# EAGLE design DAC_Production (EAGLE 9.0.0)
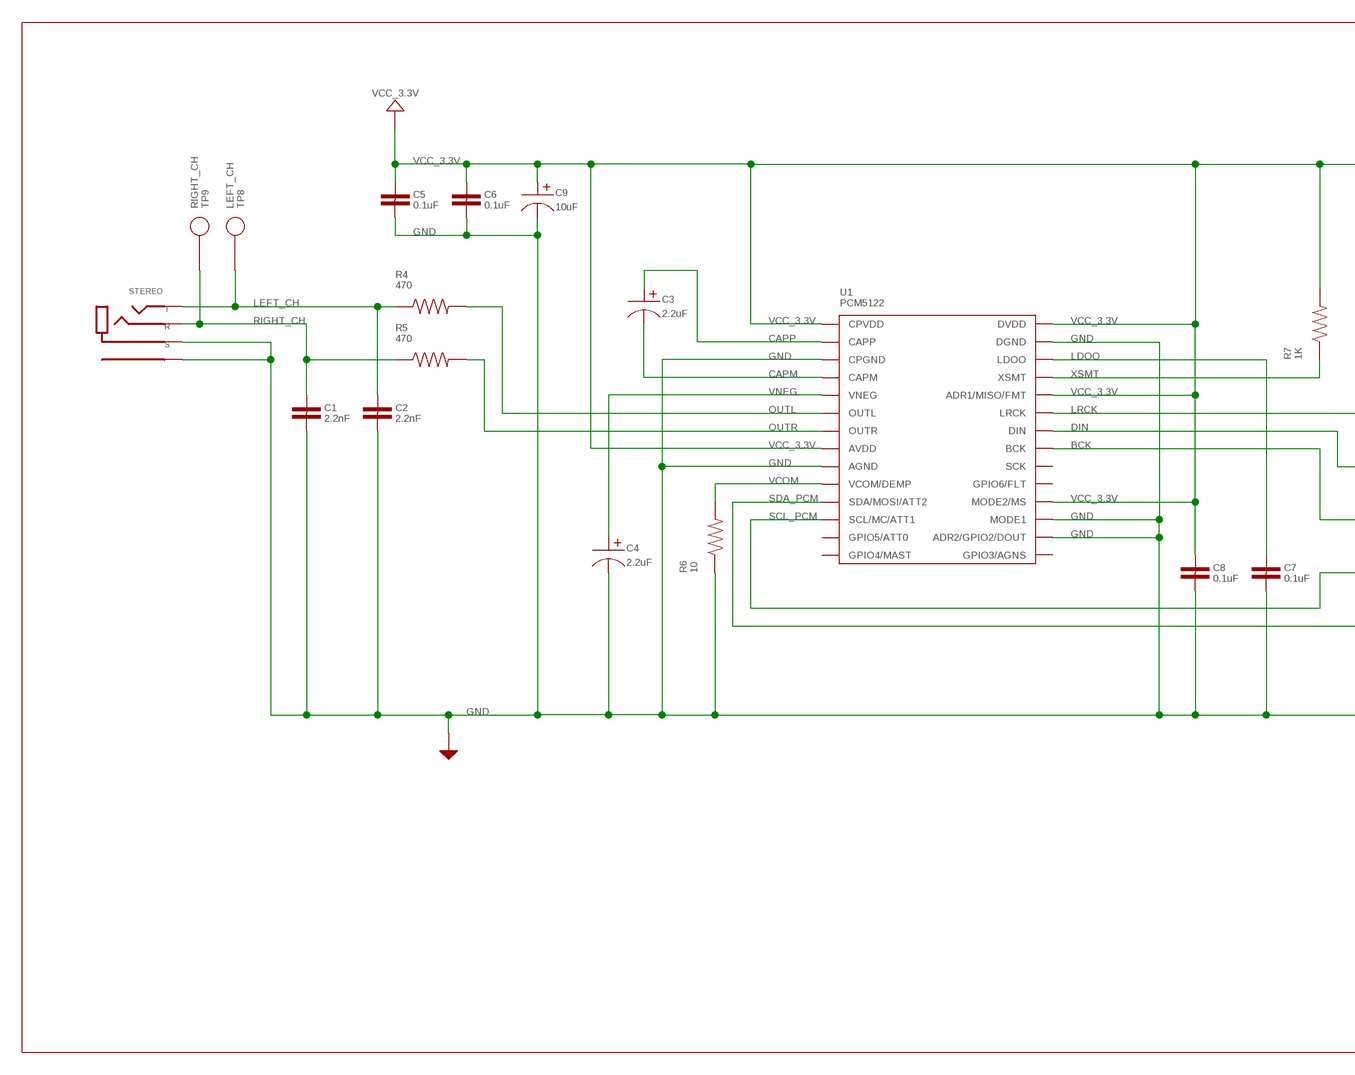
[diagram p0: schematic, sheet 1, part 1 of 2]
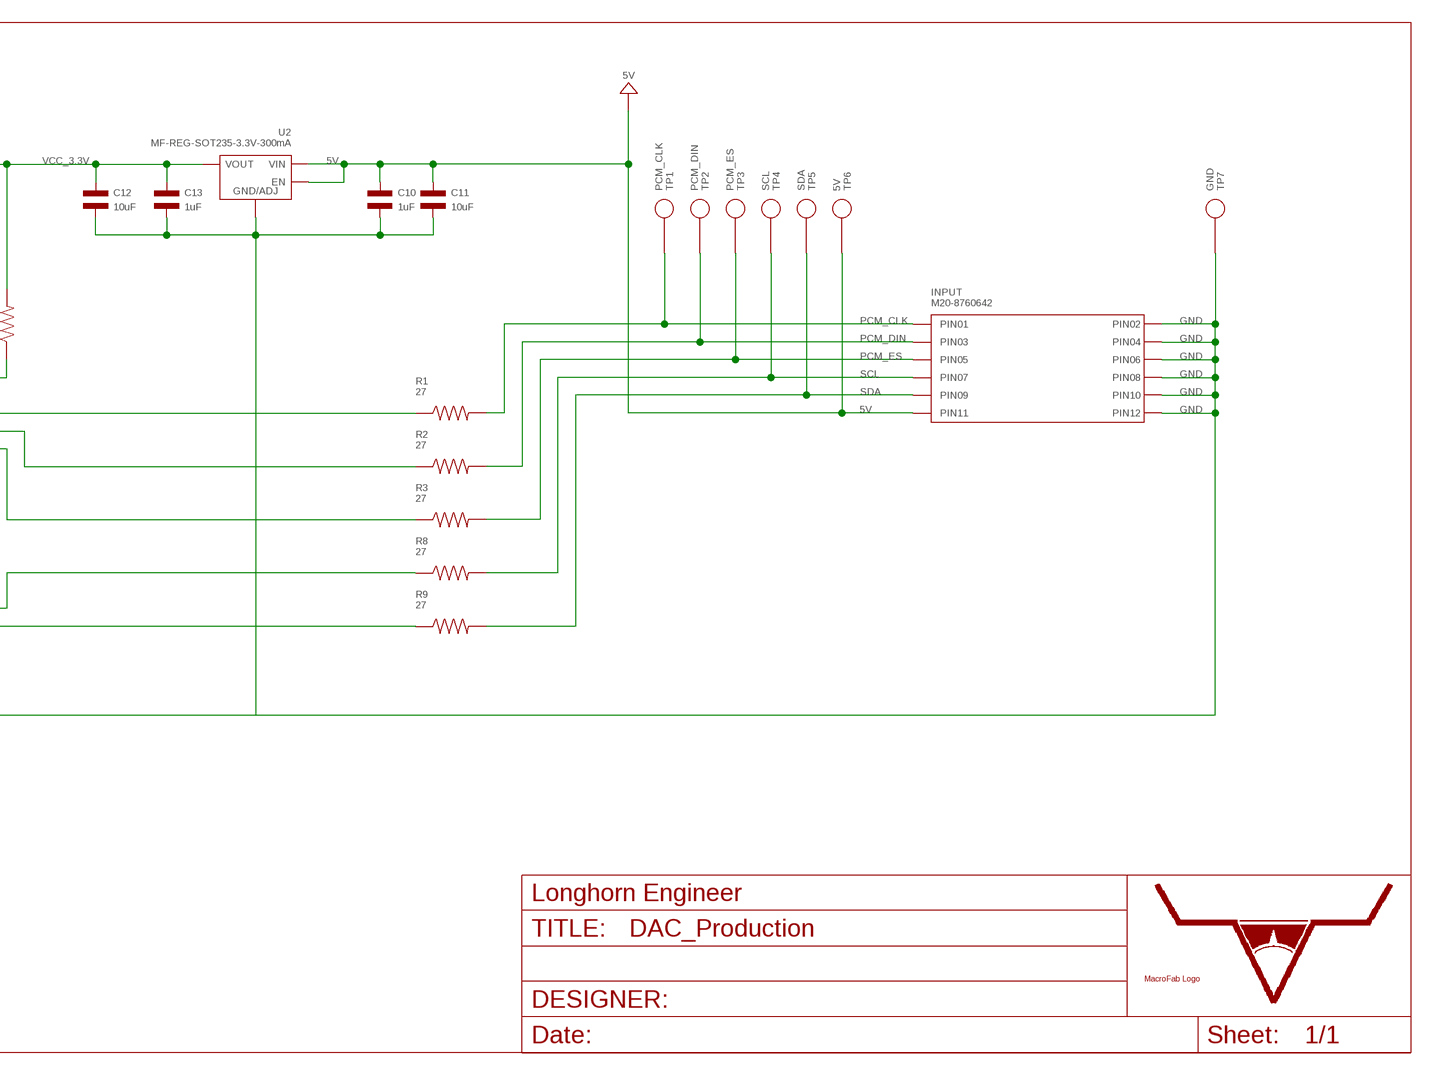
[diagram p1: schematic, sheet 1, part 2 of 2]

## Parts
C1  2.2nF  CAPACITOR_NON_POLAR_0805  [0805]
C2  2.2nF  CAPACITOR_NON_POLAR_0805  [0805]
C3  2.2uF  CAPACITOR_P_4MM  [CP4MM]
C4  2.2uF  CAPACITOR_P_4MM  [CP4MM]
C5  0.1uF  CAPACITOR_NON_POLAR_0805  [0805]
C6  0.1uF  CAPACITOR_NON_POLAR_0805  [0805]
C7  0.1uF  CAPACITOR_NON_POLAR_0805  [0805]
C8  0.1uF  CAPACITOR_NON_POLAR_0805  [0805]
C9  10uF  CAPACITOR_P_4MM  [CP4MM]
C10  1uF  CAPACITOR_NP_0805  [C0805]
C11  10uF  CAPACITOR_NP_1206  [C1206]
C12  10uF  CAPACITOR_NP_1206  [C1206]
C13  1uF  CAPACITOR_NP_0805  [C0805]
INPUT  M20-8760642  CON_02X06_M20-8760642  [M20-8760642]
R1  27  RESISTOR_0603  [0603]
R2  27  RESISTOR_0603  [0603]
R3  27  RESISTOR_0603  [0603]
R4  470  RESISTOR_0603  [0603]
R5  470  RESISTOR_0603  [0603]
R6  10  RESISTOR_0603  [0603]
R7  1K  RESISTOR_0603  [0603]
R8  27  RESISTOR_0603  [0603]
R9  27  RESISTOR_0603  [0603]
STEREO  TRS_SHIELD_JACK_SJ1-3533NS  [SJ1-3533NS]
TP1  PCM_CLK  TEST_POINT_SINGLE_ROUND_1MM  [ROUND_TP]
TP2  PCM_DIN  TEST_POINT_SINGLE_ROUND_1MM  [ROUND_TP]
TP3  PCM_ES  TEST_POINT_SINGLE_ROUND_1MM  [ROUND_TP]
TP4  SCL  TEST_POINT_SINGLE_ROUND_1MM  [ROUND_TP]
TP5  SDA  TEST_POINT_SINGLE_ROUND_1MM  [ROUND_TP]
TP6  5V  TEST_POINT_SINGLE_ROUND_1MM  [ROUND_TP]
TP7  GND  TEST_POINT_SINGLE_ROUND_1MM  [ROUND_TP]
TP8  LEFT_CH  TEST_POINT_SINGLE_ROUND_1MM  [ROUND_TP]
TP9  RIGHT_CH  TEST_POINT_SINGLE_ROUND_1MM  [ROUND_TP]
U1  PCM5122  PCM512X  [PCM5122_TTSOP-28]
U2  MF-REG-SOT235-3.3V-300mA  TLV70233PDBVR  [SOT-23-5]
U$8  LHE_FRAME  [LHE_FRAME]
U$9  MF_LOGOLOGO_MEDIUM  [MF_LOGO_MEDIUM]

## Nets
5V: C10.P$1 C11.P$1 INPUT.P$11(PIN11) TP6.P$1 U2.P$1(VIN) U2.P$3(EN)
BCK: R3.1 U1.P$21(BCK)
CAPM: C3.P$2 U1.P$4(CAPM)
CAPP: C3.P$1 U1.P$2(CAPP)
DIN: R2.1 U1.P$22(DIN)
GND: C1.2 C2.2 C4.P$2 C5.2 C6.2 C7.2 C8.2 C9.P$2 C10.P$2 C11.P$2 C12.P$2 C13.P$2 INPUT.P$2(PIN2) INPUT.P$4(PIN4) INPUT.P$6(PIN6) INPUT.P$8(PIN8) INPUT.P$10(PIN10) INPUT.P$12(PIN12) R6.1 STEREO.1_A(S) STEREO.1_B(S) STEREO.S1(SHIELD) STEREO.S2(SHIELD) STEREO.S3(SHIELD) STEREO.S4(SHIELD) STEREO.S5(SHIELD) STEREO.S6(SHIELD) TP7.P$1 U1.P$3(CPGND) U1.P$9(AGND) U1.P$16(ADR2/GPIO2/DOUT) U1.P$17(MODE1) U1.P$27(DGND) U2.P$2(GND/ADJ)
LDOO: C7.1 U1.P$26(LDOO)
LEFT_CH: C2.1 R4.1 STEREO.2_A(T) STEREO.2_B(T) TP8.P$1
LRCK: R1.1 U1.P$23(LRCK)
OUTL: R4.2 U1.P$6(OUTL)
OUTR: R5.2 U1.P$7(OUTR)
PCM_CLK: INPUT.P$1(PIN1) R1.2 TP1.P$1
PCM_DIN: INPUT.P$3(PIN3) R2.2 TP2.P$1
PCM_ES: INPUT.P$5(PIN5) R3.2 TP3.P$1
RIGHT_CH: C1.1 R5.1 STEREO.3_A(R) STEREO.3_B(R) TP9.P$1
SCL: INPUT.P$7(PIN7) R8.2 TP4.P$1
SCL_PCM: R8.1 U1.P$12(SCL/MC/ATT1)
SDA: INPUT.P$9(PIN9) R9.2 TP5.P$1
SDA_PCM: R9.1 U1.P$11(SDA/MOSI/ATT2)
VCC_3.3V: C5.1 C6.1 C8.1 C9.P$1 C12.P$1 C13.P$1 R7.2 U1.P$1(CPVDD) U1.P$8(AVDD) U1.P$18(MODE2/MS) U1.P$24(ADR1/MISO/FMT) U1.P$28(DVDD) U2.P$5(VOUT)
VCOM: R6.2 U1.P$10(VCOM/DEMP)
VNEG: C4.P$1 U1.P$5(VNEG)
XSMT: R7.1 U1.P$25(XSMT)
Unconnected: U1.P$13(GPIO5/ATT0) U1.P$14(GPIO4/MAST) U1.P$15(GPIO3/AGNS) U1.P$19(GPIO6/FLT) U1.P$20(SCK)

## Library data of the parts
C1 C2 = PP_Passives:CAPACITOR_NON_POLAR: Capacitor Non Polarized; MPN: VJ0805A222KXXPW1BC
C3 C4 = MF_Passives:CAPACITOR_P: Library: MF_Passives Description: Device for Polarized Capacitors. Manufacture part number (MPN), Voltage Rating, and Tolerance can be added via Attributes. Check https://factory.macrofab.com/parts for the house parts list.; MPN: UUQ1H2R2MCL1GB; POPULATE: 1
C5-C8 = PP_Passives:CAPACITOR_NON_POLAR: Capacitor Non Polarized; MPN: 885012207072
C9 = MF_Passives:CAPACITOR_P: Library: MF_Passives Description: Device for Polarized Capacitors. Manufacture part number (MPN), Voltage Rating, and Tolerance can be added via Attributes. Check https://factory.macrofab.com/parts for the house parts list.; MPN: UUQ1A100MCL1GB; POPULATE: 1
C10 C13 = MF_Passives:CAPACITOR_NP: Library: MF_Passives Description: Device for Non-Polarized Capacitors. Manufacture part number (MPN) can be added via Attributes. Check https://factory.macrofab.com/parts for the house parts list.; MPN: MF-CAP-0805-1uF; POPULATE: 1
C11 C12 = MF_Passives:CAPACITOR_NP: Library: MF_Passives Description: Device for Non-Polarized Capacitors. Manufacture part number (MPN) can be added via Attributes. Check https://factory.macrofab.com/parts for the house parts list.; MPN: MF-CAP-1206-10uF; POPULATE: 1
INPUT = PP_Connectors:CON_02X06; LABEL01: PCM_CLK; LABEL02: GND; LABEL03: PCM_DIN; LABEL04: GND; LABEL05: PCM_ES; LABEL06: GND; LABEL07: SCL; LABEL08: GND; LABEL09: SDA; LABEL10: GND; LABEL11: 5V; LABEL12: GND
R1-R3 R8 R9 = PP_Passives:RESISTOR: Resistors; MPN: MF-RES-0603-27
R4 R5 = PP_Passives:RESISTOR: Resistors; MPN: MF-RES-0603-470
R6 = PP_Passives:RESISTOR: Resistors; MPN: MF-RES-0603-10
R7 = PP_Passives:RESISTOR: Resistors; MPN: MF-RES-0603-1K
STEREO = PP_Connectors:TRS_SHIELD_JACK; POPULATE: 1
TP1-TP9 = PP_Connectors:TEST_POINT_SINGLE; POPULATE: 1
U1 = PP_DigitalIC:PCM512X
U2 = MF_IC_Power:TLV702: Manufacturer Part #: TLV702 Manufacturer: Texas Instruments Description: LDO Voltage Regulators; HOUSEPART: YES; MPN: MF-REG-SOT235-3.3V-300mA; POPULATE: 1; URL: https://factory.macrofab.com/part/MF-REG-SOT235-3.3V-300mA
U$8 = PP_Aesthetics:LHE_FRAME; DNAME: Parker Dillmann; REVNUM: REV 2
U$9 = PP_Aesthetics:MF_LOGO; POPULATE: 0

## Board
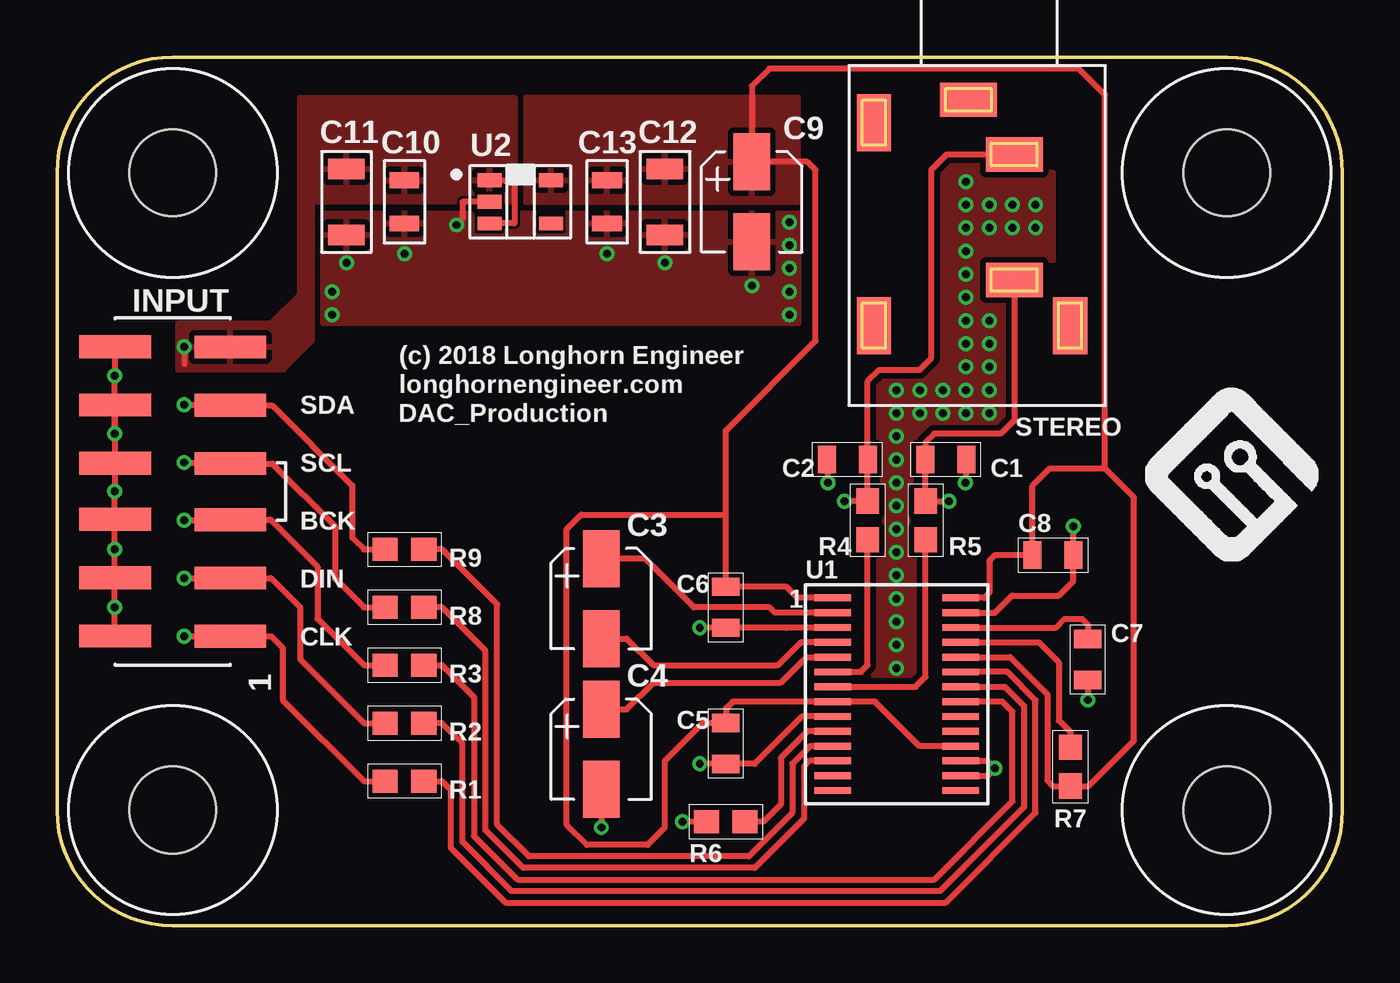
[diagram p2: board, top side]
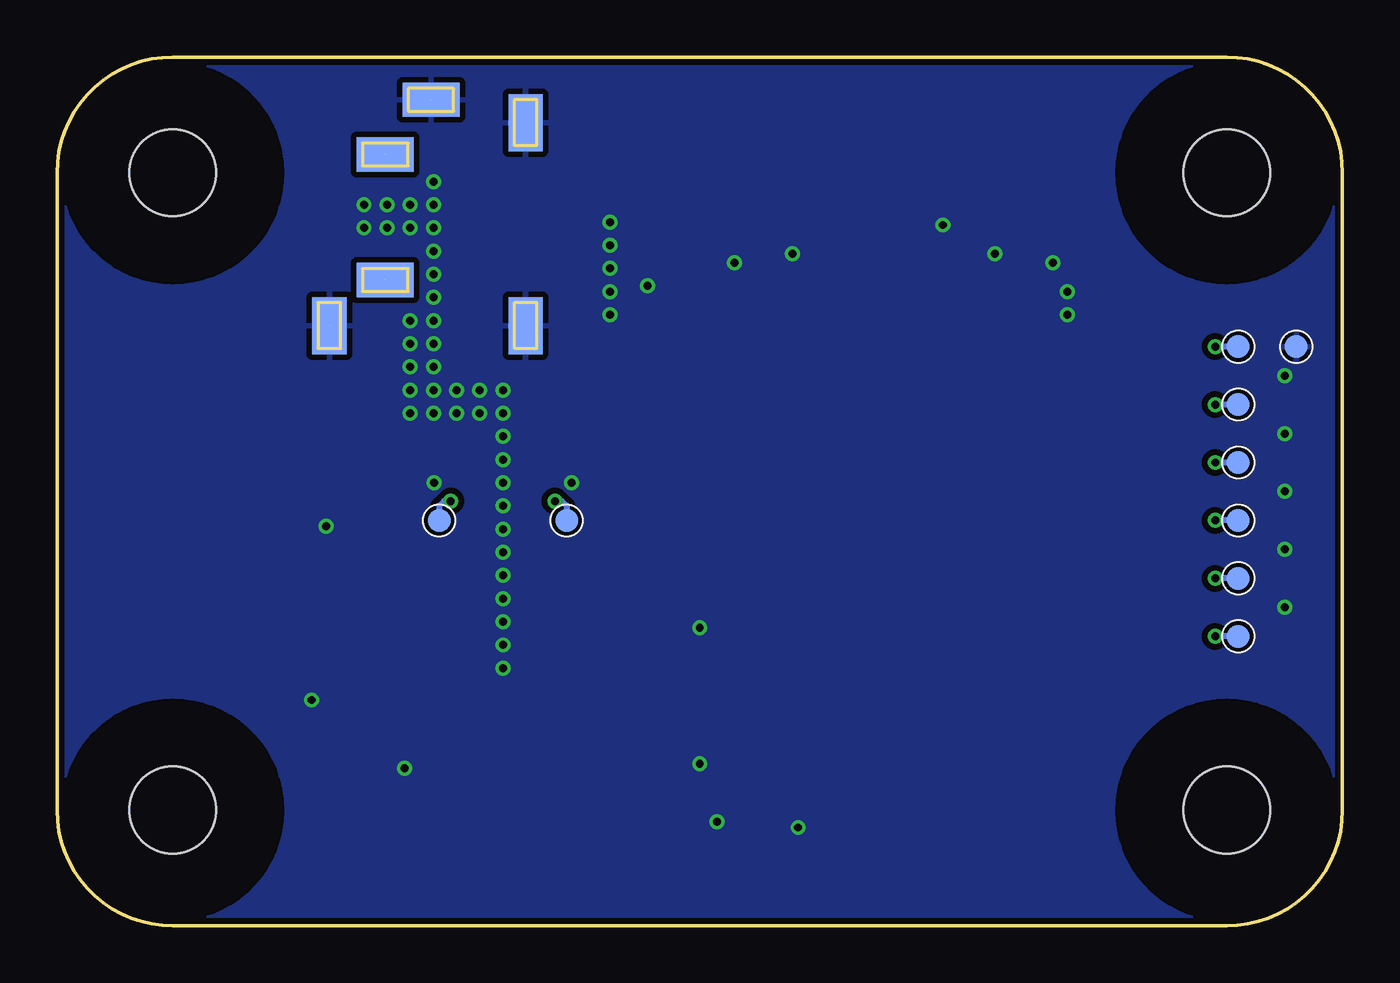
[diagram p3: board, bottom side, seen from below]

Size 56.39 x 38.1 mm. Coordinates in mm from the lower left corner, seen from the top.
Outline: 51.31,38.1 5.08,38.1 arc90 0,33.02 0,5.08 arc90 5.08,0 51.31,0 arc90 56.39,5.08 56.39,33.02 arc90 51.31,38.1
Copper layers (1*16): Top 0.035mm / dielectric 1.5mm / Bottom 0.035mm
Design rules "MF_Standard_2_Layer": minimum track width 5mil, minimum drill 12mil, track to track 5mil, track to pad 5mil, pad to pad 5mil, via to via 5mil, smd to smd 0mil, copper to edge 10mil, drill to drill 10mil, minimum pad ring 6mil, minimum via ring 6mil, stop-mask expansion 2mil, vias tented up to drill 25mil, thermal gap 10mil

### Footprints (pad centres in the part's own frame; a part is rotated, then mirrored left to right if it is on the bottom)
0805 = smd 0.8 x 1.2: 1 -0.9,0; 2 0.9,0
CP4MM = smd 1.6 x 2.5: P$1 0,-1.75; P$2 0,1.75
C0805 = smd 0.7 x 1.3: P$1 -0.95,0; P$2 0.95,0
C1206 = smd 0.9 x 1.6: P$1 -1.45,0; P$2 1.45,0
M20-8760642 = smd 1 x 3.15: P$1 6.35,2.525; P$2 6.335,-2.525; P$3 3.795,2.525; P$4 3.78,-2.525; P$5 1.24,2.525; P$6 1.225,-2.525; P$7 -1.225,2.525; P$8 -1.24,-2.525; P$9 -3.78,2.525; P$10 -3.795,-2.525; P$11 -6.335,2.525; P$12 -6.35,-2.525
0603 = smd 1.1 x 1: 1 -0.85,0; 2 0.85,0
SJ1-3533NS = smd 1.5 x 2.5: 1_A -6,-0.4; 2_A -3.6,1.6; 3_A 1.9,1.6 | smd 1.5 x 2.5 bottom: 1_B -6,-0.4; 2_B -3.6,1.6; 3_B 1.9,1.6 | smd 2.5 x 1.5: S1 -5,-4.55; S2 3.9,-4.55; S3 3.9,4.05 | smd 2.5 x 1.5 bottom: S4 3.9,4.05; S5 3.9,-4.55; S6 -5,-4.55
ROUND_TP = smd 1 x 1: P$1 0,0
PCM5122_TTSOP-28 = smd 1.6 x 0.3: P$1 -2.8,4.225; P$2 -2.8,3.575; P$3 -2.8,2.925; P$4 -2.8,2.275; P$5 -2.8,1.625; P$6 -2.8,0.975; P$7 -2.8,0.325; P$8 -2.8,-0.325; P$9 -2.8,-0.975; P$10 -2.8,-1.625; P$11 -2.8,-2.275; P$12 -2.8,-2.925; P$13 -2.8,-3.575; P$14 -2.8,-4.225; P$15 2.8,-4.225; P$16 2.8,-3.575; P$17 2.8,-2.925; P$18 2.8,-2.275; P$19 2.8,-1.625; P$20 2.8,-0.975; P$21 2.8,-0.325; P$22 2.8,0.325; P$23 2.8,0.975; P$24 2.8,1.625; P$25 2.8,2.275; P$26 2.8,2.925; P$27 2.8,3.575; P$28 2.8,4.225
SOT-23-5 = smd 1.05 x 0.6: P$1 -1.35,0.95; P$2 -1.35,0; P$3 -1.35,-0.95; P$4 1.35,-0.95; P$5 1.35,0.95
MOUNT_HOLE_150MIL = hole 3.81: 0,0

### Placement (x,y rotation side)
C1  38.99,20.45 0 top
C2  34.67,20.45 180 top
C3  23.88,14.35 180 top
C4  23.88,7.75 180 top
C5  29.34,8 270 top
C6  29.34,13.97 270 top
C7  45.21,11.68 270 top
C8  43.69,16.26 0 top
C9  30.48,31.75 180 top
C10  15.24,31.75 270 top
C11  12.7,31.75 270 top
C12  26.67,31.75 270 top
C13  24.13,31.75 270 top
INPUT  5.08,19.05 270 top
R1  15.24,6.35 180 top
R2  15.24,8.89 180 top
R3  15.24,11.43 180 top
R4  35.56,17.78 270 top
R5  38.1,17.78 270 top
R6  29.34,4.57 0 top
R7  44.45,6.99 270 top
R8  15.24,13.97 180 top
R9  15.24,16.51 180 top
STEREO  40.39,30.23 270 top
TP1  4.57,12.7 0 bottom
TP2  4.57,15.24 0 bottom
TP3  4.57,17.78 0 bottom
TP4  4.57,20.32 0 bottom
TP5  4.57,22.86 0 bottom
TP6  4.57,25.4 0 bottom
TP7  2.03,25.4 0 bottom
TP8  34.04,17.78 0 bottom
TP9  39.62,17.78 0 bottom
U1  36.83,10.16 0 top
U2  20.32,31.75 0 top
U$4  [MOUNT_HOLE_150MIL]  5.08,33.02 0 top
U$5  [MOUNT_HOLE_150MIL]  5.08,5.08 0 top
U$6  [MOUNT_HOLE_150MIL]  51.31,5.08 0 top
U$7  [MOUNT_HOLE_150MIL]  51.31,33.02 0 top
U$8  14.99,19.56 0 top
U$9  47.75,16 0 top

### Tracks (layer width: path | path; a pad name or v marks a point on that pad's centre or on a via)
5V  (via drill 0.35)
  Top 0.254: U2.P$1 20.07,32.7 20.07,30.8 U2.P$3 | v5.59,25.4 5.59,24.64
  Bottom 0.254: TP6.P$1 v5.59,25.4
  pour Top: 20.07,36.32 20.07,31.75 11.68,31.75 11.68,36.32
  pour Top: 12.45,31.75 11.18,31.75 11.18,25.65 9.91,24.38 5.33,24.38 5.33,26.42 9.4,26.42 10.67,27.69 10.67,36.32 12.45,36.32
BCK
  Top 0.254: R3.1 16.89,11.43 18.29,10.03 18.29,3.94 20.19,2.03 38.48,2.03 41.91,5.46 41.91,9.4 41.47,9.84 U1.P$21
CAPM
  Top 0.254: U1.P$4 32.63,12.44 31.62,11.43 26.16,11.43 24.99,12.6 C3.P$2
CAPP
  Top 0.254: U1.P$2 31.48,13.73 31.24,13.97 27.94,13.97 25.81,16.1 C3.P$1
DIN
  Top 0.254: U1.P$22 41.59,10.48 42.42,9.65 42.42,5.21 38.73,1.52 19.94,1.52 17.78,3.68 17.78,8 16.89,8.89 R2.1
GND  (via drill 0.35)  (4 unrouted)
  Top 0.254: INPUT.P$2 2.54,12.71 v2.54,13.97 v2.54,16.51 | v2.54,21.59 v2.54,19.05 | v2.54,21.59 v2.54,24.13 2.54,25.4 INPUT.P$12 | INPUT.P$10 2.54,22.84 v2.54,21.59 | INPUT.P$8 2.54,20.29 v2.54,19.05 | v2.54,16.51 v2.54,19.05 | INPUT.P$4 2.54,15.27 v2.54,16.51 | INPUT.P$6 2.54,17.82 v2.54,19.05 | C7.2 v45.21,9.91 | U1.P$27 41.15,13.73 41.89,14.48 43.94,14.48 44.58,15.12 44.58,16.51 | U1.P$17 40.82,7.24 v41.15,6.91 40.82,6.58 U1.P$16 | U1.P$3 32.01,13.09 32,13.07 C6.2 v28.19,13.08 | C1.2 v39.84,19.43 | C2.2 v33.82,19.43 | C8.2 44.58,16.51 | 44.58,16.51 v44.58,17.53 | U1.P$9 32.68,9.19 30.6,7.1 C5.2 v28.19,7.11 | R6.1 v27.43,4.57 | C4.P$2 v23.88,4.32 | U2.P$2 17.78,31.75 17.78,30.99
  other vias: 36.83,11.3 36.83,12.32 36.83,13.34 36.83,14.35 36.83,15.37 36.83,16.38 36.83,17.4 36.83,18.41 36.83,19.43 36.83,20.45 36.83,21.46 36.83,22.48 36.83,23.5 12.7,29.08 15.24,29.46 17.53,30.73 24.13,29.46 26.67,29.08 30.48,28.07 32.13,26.8 32.13,27.81 32.13,28.83 32.13,29.84 32.13,30.86 12.06,26.8 12.06,27.81 37.85,23.5 38.86,23.5 38.86,22.48 37.85,22.48 39.88,22.48 40.89,22.48 40.89,23.5 39.88,23.5 40.89,24.51 40.89,25.53 40.89,26.54 39.88,24.51 39.88,25.53 39.88,26.54 39.88,27.56 39.88,28.57 39.88,29.59 39.88,30.61 39.88,31.62 39.88,32.64 40.89,30.61 41.91,30.61 42.93,30.61 42.93,31.62 41.91,31.62 40.89,31.62
  pour Bottom (isolate 0.254): 0,38.1 56.39,38.1 56.39,0 0,0
  pour Top: 11.68,31.24 32.51,31.24 32.51,26.42 11.68,26.42
  pour Top (isolate 0.254): 35.56,10.41 38.1,10.41 38.1,21.59 41.91,21.59 41.91,29.21 43.69,29.21 43.69,33.02 40.89,33.02 40.89,33.78 38.35,33.78 38.35,24.38 35.56,24.38
LDOO
  Top 0.254: U1.P$26 43.82,13.09 44.2,13.46 44.96,13.46 45.21,13.21 C7.1
LEFT_CH  (via drill 0.35)  (1 unrouted)
  Top 0.254: C2.1 R4.1 v34.54,18.63 | C2.1 | C2.1 35.56,23.88 36.07,24.38 37.85,24.38 38.35,24.89 38.35,33.15 39.03,33.83 STEREO.2_A
  Bottom 0.254: v34.54,18.63 34.25,18.63 34.04,18.41 TP8.P$1
LRCK
  Top 0.254: R1.1 16.89,6.35 17.27,5.97 17.27,3.43 19.68,1.02 38.99,1.02 42.93,4.95 42.93,9.91 41.7,11.13 U1.P$23
OUTL
  Top 0.254: U1.P$6 35.27,11.13 35.56,11.43 R4.2
OUTR
  Top 0.254: U1.P$7 37.66,10.48 38.1,10.92 R5.2
PCM_CLK  (via drill 0.35)
  Top 0.254: R1.2 13.46,6.35 9.91,9.91 9.91,12.19 9.4,12.7 INPUT.P$1 v5.59,12.7
  Bottom 0.254: TP1.P$1 v5.59,12.7
PCM_DIN  (via drill 0.35)
  Top 0.254: R2.2 13.46,8.89 10.67,11.68 10.67,13.97 9.38,15.26 INPUT.P$3 7.61,15.24 v5.59,15.24
  Bottom 0.254: TP2.P$1 v5.59,15.24
PCM_ES  (via drill 0.35)
  Top 0.254: R3.2 13.46,11.43 11.43,13.46 11.43,15.75 9.37,17.81 INPUT.P$5 7.61,17.78 v5.59,17.78
  Bottom 0.254: TP3.P$1 v5.59,17.78
RIGHT_CH  (via drill 0.35)  (1 unrouted)
  Top 0.254: C1.1 R5.1 v39.12,18.63 | C1.1 | STEREO.3_B 41.99,22.17 41.4,21.59 38.48,21.59 38.1,21.21 C1.1
  Bottom 0.254: v39.12,18.63 39.41,18.63 39.62,18.41 TP9.P$1
SCL  (via drill 0.35)
  Top 0.254: R8.2 13.46,13.97 12.19,15.24 12.19,17.53 9.44,20.27 INPUT.P$7 7.61,20.32 v5.59,20.32
  Bottom 0.254: TP4.P$1 v5.59,20.32
SCL_PCM
  Top 0.254: U1.P$12 33.02,7.24 32.77,6.99 32.77,4.7 30.61,2.54 20.45,2.54 18.8,4.19 18.8,12.06 16.89,13.97 R8.1
SDA  (via drill 0.35)
  Top 0.254: R9.2 13.46,16.51 12.95,17.02 12.95,19.3 9.43,22.83 INPUT.P$9 7.61,22.86 v5.59,22.86
  Bottom 0.254: TP5.P$1 v5.59,22.86
SDA_PCM
  Top 0.254: U1.P$11 33.03,7.88 32.26,7.11 32.26,4.95 30.35,3.05 20.7,3.05 19.3,4.45 19.3,14.1 16.89,16.51 R9.1
VCC_3.3V
  Top 0.254: U1.P$1 32.48,14.38 32,14.87 C6.1 29.34,18.03 | U1.P$28 40.67,14.38 40.89,14.61 40.89,16 41.15,16.26 C8.1 42.79,19.29 43.56,20.07 45.97,20.07 | 29.34,18.03 29.34,21.72 33.27,25.65 33.27,33.15 32.92,33.5 C9.P$1 30.48,36.83 31.24,37.59 44.83,37.59 45.97,36.45 45.97,20.07 | 29.34,18.03 22.99,18.03 22.35,17.4 22.35,4.45 23.24,3.56 25.91,3.56 26.67,4.32 26.67,7.24 28.33,8.9 C5.1 29.34,9.53 29.65,9.84 U1.P$8 35.88,9.84 37.84,7.88 U1.P$18 | 45.97,20.07 47.24,18.8 47.24,8.13 45.25,6.13 R7.2 43.69,6.13 43.43,6.39 43.43,10.16 41.81,11.79 U1.P$24
  pour Top: 20.57,31.75 32.51,31.75 32.51,36.32 20.57,36.32
VCOM
  Top 0.254: U1.P$10 32.92,8.54 31.75,7.37 31.75,5.33 30.99,4.57 R6.2
VNEG
  Top 0.254: U1.P$5 32.87,11.79 31.75,10.67 26.16,10.67 24.99,9.5 C4.P$1
XSMT
  Top 0.254: U1.P$25 43.06,12.44 43.94,11.56 43.94,9.02 44.45,8.51 R7.1

### Text on the board
tPlace: SDA | SCL | BCK | DIN | CLK